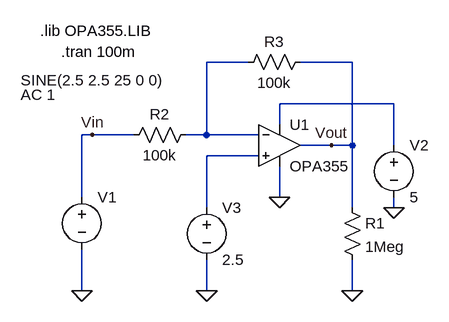
[diagram p0: schematic Draft3.asc]
Draft3.asc, the LTspice schematic file:
Version 4
SHEET 1 880 680
WIRE 240 144 176 144
WIRE 400 144 320 144
WIRE 464 208 288 208
WIRE 288 240 288 208
WIRE 0 256 -16 256
WIRE 64 256 0 256
WIRE 176 256 176 144
WIRE 176 256 144 256
WIRE 256 256 176 256
WIRE 368 272 320 272
WIRE 400 272 400 144
WIRE 400 272 368 272
WIRE 464 272 464 208
WIRE 256 288 176 288
WIRE -16 352 -16 256
WIRE 288 352 288 304
WIRE 176 368 176 288
WIRE 400 368 400 272
WIRE 464 368 464 352
WIRE -16 496 -16 432
WIRE 176 496 176 448
WIRE 400 496 400 448
FLAG -16 496 0
FLAG 176 496 0
FLAG 400 496 0
FLAG 464 368 0
FLAG 288 352 0
FLAG 0 256 Vin
FLAG 368 272 Vout
SYMBOL res 384 352 R0
SYMATTR InstName R1
SYMATTR Value 1Meg
SYMBOL res 160 240 R90
WINDOW 0 0 56 VBottom 2
WINDOW 3 32 56 VTop 2
SYMATTR InstName R2
SYMATTR Value 100k
SYMBOL res 336 128 R90
WINDOW 0 0 56 VBottom 2
WINDOW 3 32 56 VTop 2
SYMATTR InstName R3
SYMATTR Value 100k
SYMBOL voltage 464 256 R0
SYMATTR InstName V2
SYMATTR Value 5
SYMBOL voltage 176 352 R0
SYMATTR InstName V3
SYMATTR Value 2.5
SYMBOL voltage -16 336 R0
WINDOW 3 -94 -164 Left 2
WINDOW 123 -94 -142 Left 2
SYMATTR InstName V1
SYMATTR Value SINE(2.5 2.5 25 0 0)
SYMATTR Value2 AC 1
SYMBOL OpAmps/opamp2 288 208 R0
SYMATTR InstName U1
SYMATTR Value OPA355
SYMATTR SpiceModel OPA355
TEXT -48 128 Left 2 !.tran 100m
TEXT -80 96 Left 2 !.lib OPA355.LIB

The netlist it stands for:
* Draft3.asc
R1 Vout 0 1Meg
R2 N001 Vin 100k
R3 Vout N001 100k
V2 N002 0 5
V3 N003 0 2.5
V1 Vin 0 SINE(2.5 2.5 25 0 0) AC 1
XU1 N003 N001 N002 0 Vout OPA355 OPA355  ; pins In+ In- V+ V- OUT
.tran 100m
.lib OPA355.LIB
.backanno
.end